# Altium schematic sheet sch_cm4.SchDoc
size A3; SheetNumber: 1; SheetTotal: 7
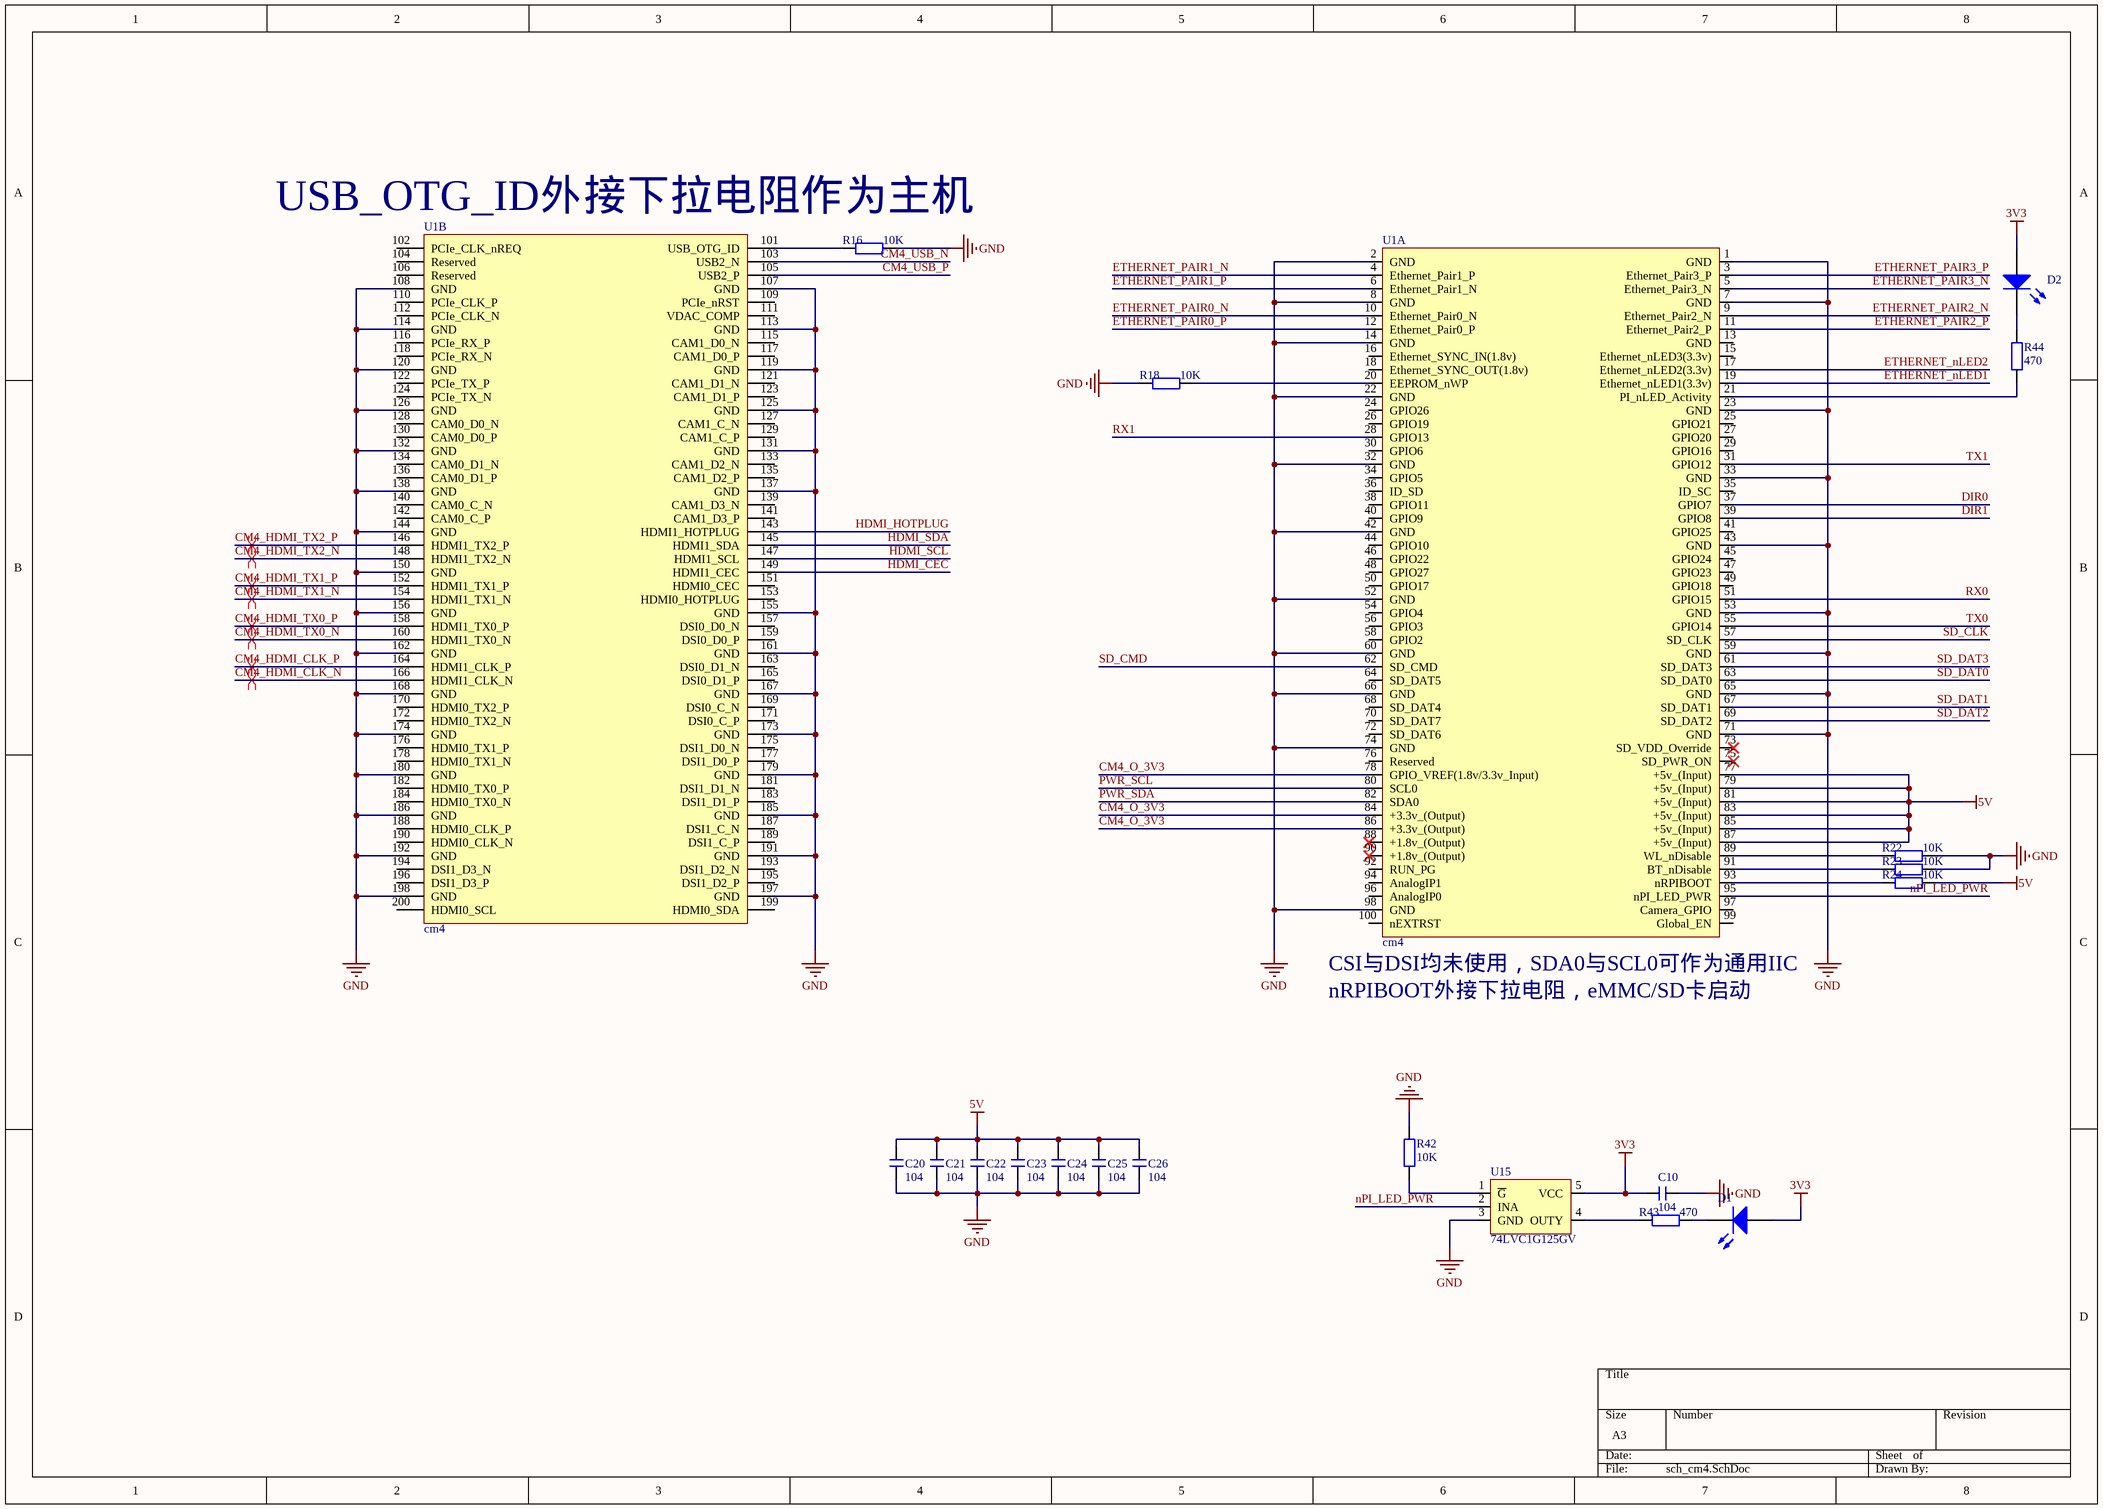
[diagram p0: sch_cm4.SchDoc]

## Parts
C10  104  [C 0402_L]
C20  104  [C 0402_L]
C21  104  [C 0402_L]
C22  104  [C 0402_L]
C23  104  [C 0402_L]
C24  104  [C 0402_L]
C25  104  [C 0402_L]
C26  104  [C 0402_L]
D1  Light-Emitting Diode  (value not drawn)
D2  Light-Emitting Diode  (value not drawn)
R16  10K  [R 0805_L]
R18  10K  [R 0805_L]
R22  10K  [R 0805_L]
R23  10K  [R 0805_L]
R24  10K  [R 0805_L]
R42  10K  [R 0805_L]
R43  470  [R 0805_L]
R44  470  [R 0805_L]
U1  cm4  [Pi-cm4]  (parts A,B of 2)
U15  74LVC1G125GV  [SOT-23-5_L2.9-W1.6-P0.95-LS2.8-BR]

## Nets
3V3: C10.2 D1.1(A) D2.1(A) U15.5(VCC)
5V: C20.2 C21.2 C22.2 C23.2 C24.2 C25.2 C26.2 R24.2 U1.77(+5v_(Input)) U1.79(+5v_(Input)) U1.81(+5v_(Input)) U1.83(+5v_(Input)) U1.85(+5v_(Input)) U1.87(+5v_(Input))
GND: C10.1 C20.1 C21.1 C22.1 C23.1 C24.1 C25.1 C26.1 R16.2 R18.1 R22.2 R23.2 R42.1 U1.1(GND) U1.2(GND) U1.7(GND) U1.8(GND) U1.14(GND) U1.22(GND) U1.23(GND) U1.32(GND) U1.33(GND) U1.42(GND) U1.43(GND) U1.52(GND) U1.53(GND) U1.59(GND) U1.60(GND) U1.65(GND) U1.66(GND) U1.71(GND) U1.74(GND) U1.98(GND) U1.107(GND) U1.108(GND) U1.113(GND) U1.114(GND) U1.119(GND) U1.120(GND) U1.125(GND) U1.126(GND) U1.131(GND) U1.132(GND) U1.137(GND) U1.138(GND) U1.144(GND) U1.150(GND) U1.155(GND) U1.156(GND) U1.161(GND) U1.162(GND) U1.167(GND) U1.168(GND) U1.173(GND) U1.174(GND) U1.179(GND) U1.180(GND) U1.185(GND) U1.186(GND) U1.191(GND) U1.192(GND) U1.197(GND) U1.198(GND) U15.3(GND)
CM4_HDMI_CLK_N: U1.166(HDMI1_CLK_N)
CM4_HDMI_CLK_P: U1.164(HDMI1_CLK_P)
CM4_HDMI_TX0_N: U1.160(HDMI1_TX0_N)
CM4_HDMI_TX0_P: U1.158(HDMI1_TX0_P)
CM4_HDMI_TX1_N: U1.154(HDMI1_TX1_N)
CM4_HDMI_TX1_P: U1.152(HDMI1_TX1_P)
CM4_HDMI_TX2_N: U1.148(HDMI1_TX2_N)
CM4_HDMI_TX2_P: U1.146(HDMI1_TX2_P)
CM4_O_3V3: U1.78(GPIO_VREF(1.8v/3.3v_Input)) U1.84(+3.3v_(Output)) U1.86(+3.3v_(Output))
CM4_USB_N: U1.103(USB2_N)
CM4_USB_P: U1.105(USB2_P)
DIR0: U1.37(GPIO7)
DIR1: U1.39(GPIO8)
ETHERNET_nLED1: U1.19(Ethernet_nLED1(3.3v))
ETHERNET_nLED2: U1.17(Ethernet_nLED2(3.3v))
ETHERNET_PAIR0_N: U1.10(Ethernet_Pair0_N)
ETHERNET_PAIR0_P: U1.12(Ethernet_Pair0_P)
ETHERNET_PAIR1_N: U1.4(Ethernet_Pair1_P)
ETHERNET_PAIR1_P: U1.6(Ethernet_Pair1_N)
ETHERNET_PAIR2_N: U1.9(Ethernet_Pair2_N)
ETHERNET_PAIR2_P: U1.11(Ethernet_Pair2_P)
ETHERNET_PAIR3_N: U1.5(Ethernet_Pair3_N)
ETHERNET_PAIR3_P: U1.3(Ethernet_Pair3_P)
HDMI_CEC: U1.149(HDMI1_CEC)
HDMI_HOTPLUG: U1.143(HDMI1_HOTPLUG)
HDMI_SCL: U1.147(HDMI1_SCL)
HDMI_SDA: U1.145(HDMI1_SDA)
nPI_LED_PWR: U1.95(nPI_LED_PWR) U15.2(INA)
PWR_SCL: U1.80(SCL0)
PWR_SDA: U1.82(SDA0)
RX0: U1.51(GPIO15)
RX1: U1.28(GPIO13)
SD_CLK: U1.57(SD_CLK)
SD_CMD: U1.62(SD_CMD)
SD_DAT0: U1.63(SD_DAT0)
SD_DAT1: U1.67(SD_DAT1)
SD_DAT2: U1.69(SD_DAT2)
SD_DAT3: U1.61(SD_DAT3)
TX0: U1.55(GPIO14)
TX1: U1.31(GPIO12)
NetD1_2: D1.2(K) R43.2
NetD2_2: D2.2(K) R44.2
NetR16_1: R16.1 U1.101(USB_OTG_ID)
NetR18_2: R18.2 U1.20(EEPROM_nWP)
NetR22_1: R22.1 U1.89(WL_nDisable)
NetR23_1: R23.1 U1.91(BT_nDisable)
NetR24_1: R24.1 U1.93(nRPIBOOT)
NetR42_2: R42.2 U15.1(~{G})
NetR43_1: R43.1 U15.4(OUTY)
NetR44_1: R44.1 U1.21(PI_nLED_Activity)

Not connected (* = marked no-connect by the designer): U1 13(GND) 15(Ethernet_nLED3(3.3v)) 16(Ethernet_SYNC_IN(1.8v)) 18(Ethernet_SYNC_OUT(1.8v)) 24(GPIO26) 25(GPIO21) 26(GPIO19) 27(GPIO20) 29(GPIO16) 30(GPIO6) 34(GPIO5) 35(ID_SC) 36(ID_SD) 38(GPIO11) 40(GPIO9) 41(GPIO25) 44(GPIO10) 45(GPIO24) 46(GPIO22) 47(GPIO23) 48(GPIO27) 49(GPIO18) 50(GPIO17) 54(GPIO4) 56(GPIO3) 58(GPIO2) 64(SD_DAT5) 68(SD_DAT4) 70(SD_DAT7) 72(SD_DAT6) 73(SD_VDD_Override)* 75(SD_PWR_ON)* 76(Reserved) 88(+1.8v_(Output))* 90(+1.8v_(Output))* 92(RUN_PG) 94(AnalogIP1) 96(AnalogIP0) 97(Camera_GPIO) 99(Global_EN) 100(nEXTRST) 102(PCIe_CLK_nREQ) 104(Reserved) 106(Reserved) 109(PCIe_nRST) 110(PCIe_CLK_P) 111(VDAC_COMP) 112(PCIe_CLK_N) 115(CAM1_D0_N) 116(PCIe_RX_P) 117(CAM1_D0_P) 118(PCIe_RX_N) 121(CAM1_D1_N) 122(PCIe_TX_P) 123(CAM1_D1_P) 124(PCIe_TX_N) 127(CAM1_C_N) 128(CAM0_D0_N) 129(CAM1_C_P) 130(CAM0_D0_P) 133(CAM1_D2_N) 134(CAM0_D1_N) 135(CAM1_D2_P) 136(CAM0_D1_P) 139(CAM1_D3_N) 140(CAM0_C_N) 141(CAM1_D3_P) 142(CAM0_C_P) 151(HDMI0_CEC) 153(HDMI0_HOTPLUG) 157(DSI0_D0_N) 159(DSI0_D0_P) 163(DSI0_D1_N) 165(DSI0_D1_P) 169(DSI0_C_N) 170(HDMI0_TX2_P) 171(DSI0_C_P) 172(HDMI0_TX2_N) 175(DSI1_D0_N) 176(HDMI0_TX1_P) 177(DSI1_D0_P) 178(HDMI0_TX1_N) 181(DSI1_D1_N) 182(HDMI0_TX0_P) 183(DSI1_D1_P) 184(HDMI0_TX0_N) 187(DSI1_C_N) 188(HDMI0_CLK_P) 189(DSI1_C_P) 190(HDMI0_CLK_N) 193(DSI1_D2_N) 194(DSI1_D3_N) 195(DSI1_D2_P) 196(DSI1_D3_P) 199(HDMI0_SDA) 200(HDMI0_SCL)

## Layout directives
differential pair: CM4_HDMI_CLK_N, CM4_HDMI_CLK_P, CM4_HDMI_TX0_N, CM4_HDMI_TX0_P, CM4_HDMI_TX1_N, CM4_HDMI_TX1_P, CM4_HDMI_TX2_N, CM4_HDMI_TX2_P

## Notes on the sheet
- (near U1) USB_OTG_ID外接下拉电阻作为主机
- (near U1) CSI与DSI均未使用，SDA0与SCL0可作为通用IIC
- nRPIBOOT外接下拉电阻，eMMC/SD卡启动

## Library data of the parts
C10 C20-C26 = C: 贴片电容; BOM名称: 无极性贴片电容; 淘宝ID: 封装库来自淘宝 ID：黄晶宝石; 联系售后，技术支持: https://shop463601444.taobao.com; 唯一出售店铺网址: https://shop463601444.taobao.com
D1 D2 = LED: AF: 1; BV: 0; BV_MAX: 1e99; EG: 1.11; FC: 0.5; IBV: 0.001; IS: 1e-14; MJSW: 0.33; NTUN: 30; TNOM: 27; XTI: 3; SimulationGenericComponent: True; CJO: 0; CJP: 0; CTA: 0; CTP: 0; FCS: 0.5; FV_MAX: 1e99; IKF: 0; IKR: 0; ISR: 1e-14; JSW: 0; JTUN: 0; JTUNSW: 0; KEG: 1; KF: 0; LEVEL: 1; N: 1; NBV: 1; NR: 1; NS: 1; PHP: 1; RS: 0; TCV: 0; TLEV: 0; TLEVC: 0; TM1: 0; TM2: 0; TPB: 0; TPHP: 0; TRS: 0; TRS2: 0; TT: 0; TTT1: 0; TTT2: 0; VJ: 1; XTITUN: 3
R16 R18 R22-R24 R42-R44 = R: 贴片电阻; 版权归属: 来自淘宝 ID：黄晶宝石; 封装库来自淘宝卖家 ID：黄晶宝石: 其他店铺购入均为盗版，不享受售后技术支持服务，请立即申请退款; BOM名称: 贴片电阻; 联系售后: https://item.taobao.com/item.htm?id=566775463719
U1 = ComputerModule4
U15 = 74LVC1G125GV: 缓冲器